# Altium schematic sheet Cat_feeder.SchDoc
size A
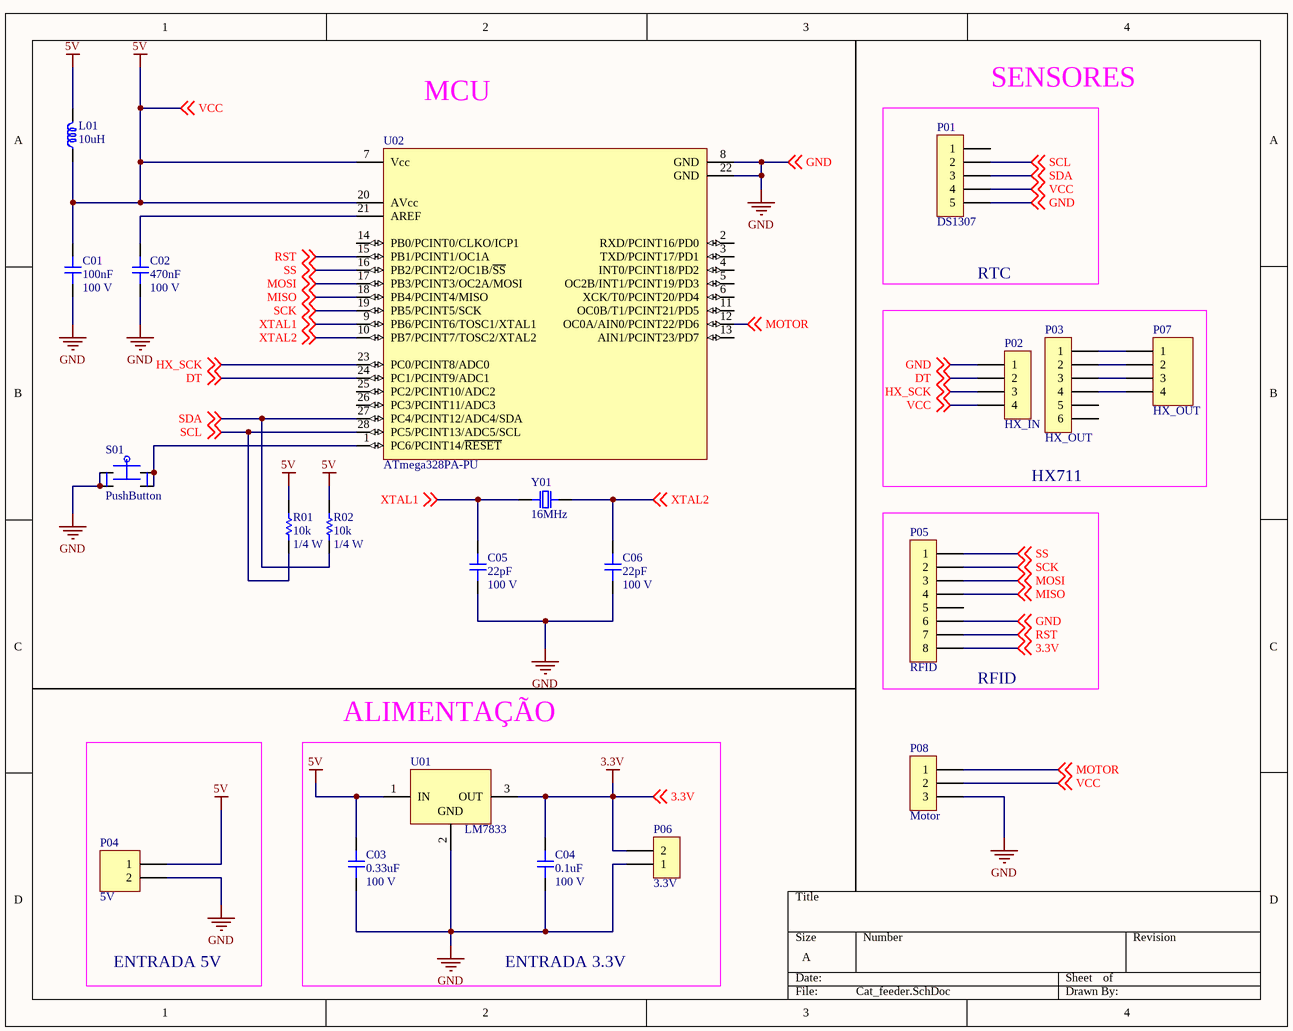
[diagram p0: Cat_feeder.SchDoc]

## Parts
C01  100nF  Voltage: 100 V  [C100-200-100]
C02  470nF  Voltage: 100 V  [C100-200-100]
C03  0.33uF  Voltage: 100 V  [C200-350-150]
C04  0.1uF  Voltage: 100 V  [C200-350-150]
C05  22pF  Voltage: 100 V  [C100-200-100]
C06  22pF  Voltage: 100 V  [C100-200-100]
L01  10uH  [L400-2.0mm]
P01  DS1307  [HDR-M-1x5-2.54mm-180-9.2mm]
P02  HX_IN  [HDR-M-1x4-2.54mm-180-21.1mm]
P03  HX_OUT  [HDR-M-1x6-2.54mm-180-9.2mm]
P04  5V  [KRE_2]
P05  RFID  [HDR-M-1x8-2.54mm-180-9.2mm]
P06  3.3V  [HDR-M-1x2-2.54mm-180-9.2mm]
P07  HX_OUT  [KRE_4]
P08  Motor  [HDR-M-1x3-2.54mm-180-9.2mm]
R01  10k  Power: 1/4 W  [R400-2.0mm]
R02  10k  Power: 1/4 W  [R400-2.0mm]
S01  PushButton  [DTS-6.0mm-6.0mm-THT]
U01  LM7833  [TO-220/123]
U02  ATmega328PA-PU  [DIP28-300(100)]
Y01  16MHz  [HC49-US-THT]

## Blocks framed on the sheet
SENSORES: P01
HX711: P02 P03 P07
RFID: P05
ENTRADA 5V: P04
ALIMENTAÇÃO: C03 C04 P06 U01

## Nets
3.3V: C04.2 P05.8 P06.2 U01.3(OUT) ; off-sheet 3.3V
5V: C01.2 C03.2 L01.1 L01.2 P01.4 P02.4 P04.1 P08.2 R01.2 R02.2 U01.1(IN) U02.7(Vcc) U02.20(AVcc) ; off-sheet VCC  [also labelled VCC]
GND: C01.1 C02.1 C03.1 C04.1 C05.1 C06.1 P01.5 P02.1 P04.2 P05.6 P06.1 P08.3 S01.1 S01.2 U01.2(GND) U02.8(GND) U02.22(GND) ; off-sheet GND
DT: P02.2 U02.24(PC1/PCINT9/ADC1) ; off-sheet DT
HX_SCK: P02.3 U02.23(PC0/PCINT8/ADC0) ; off-sheet HX_SCK
MISO: P05.4 U02.18(PB4/PCINT4/MISO) ; off-sheet MISO
MOSI: P05.3 U02.17(PB3/PCINT3/OC2A/MOSI) ; off-sheet MOSI
MOTOR: P08.1 U02.12(OC0A/AIN0/PCINT22/PD6) ; off-sheet MOTOR
RST: P05.7 U02.15(PB1/PCINT1/OC1A) ; off-sheet RST
SCK: P05.2 U02.19(PB5/PCINT5/SCK) ; off-sheet SCK
SCL: P01.2 R01.1 U02.28(PC5/PCINT13/ADC5/SCL) ; off-sheet SCL
SDA: P01.3 R02.1 U02.27(PC4/PCINT12/ADC4/SDA) ; off-sheet SDA
SS: P05.1 U02.16(PB2/PCINT2/OC1B/~{SS}) ; off-sheet SS
XTAL1: C05.2 U02.9(PB6/PCINT6/TOSC1/XTAL1) Y01.1 ; off-sheet XTAL1
XTAL2: C06.2 U02.10(PB7/PCINT7/TOSC2/XTAL2) Y01.2 ; off-sheet XTAL2
NetC02_2: C02.2 U02.21(AREF)
NetP03_1: P03.1 P07.1
NetP03_2: P03.2 P07.2
NetP03_3: P03.3 P07.3
NetP03_4: P03.4 P07.4
NetS01_3: S01.3 S01.4 U02.1(PC6/PCINT14/~{RESET})

Not connected (* = marked no-connect by the designer): P01 1; P03 5 6; P05 5; U02 2(RXD/PCINT16/PD0) 3(TXD/PCINT17/PD1) 4(INT0/PCINT18/PD2) 5(OC2B/INT1/PCINT19/PD3) 6(XCK/T0/PCINT20/PD4) 11(OC0B/T1/PCINT21/PD5) 13(AIN1/PCINT23/PD7) 14(PB0/PCINT0/CLKO/ICP1) 25(PC2/PCINT10/ADC2) 26(PC3/PCINT11/ADC3)

## Notes on the sheet
- MCU
- RTC
- ENTRADA 3.3V

## Library data of the parts
C01 C02 C03 C04 C05 C06 = Capacitor: Published: 8-Jun-2000; LatestRevisionDate: 17-Jul-2002; LatestRevisionNote: Re-released for DXP Platform.; PackageReference: RAD-0.3; Publisher: Altium Limited
L01 = Inductor
P01 = Header_1x5: Header, 1 Line, 5 Columns, 5 Pins; LatestRevisionDate: 17-Jul-2002; LatestRevisionNote: Re-released for DXP Platform.; Publisher: Altium Limited
P02 = Header_1x4: Header, 1 Line, 4 Columns, 4 Pins; LatestRevisionDate: 17-Jul-2002; LatestRevisionNote: Re-released for DXP Platform.; Publisher: Altium Limited
P03 = Header_1x6: Header, 1 Line, 6 Columns, 6 Pins; LatestRevisionDate: 17-Jul-2002; LatestRevisionNote: Re-released for DXP Platform.; Publisher: Altium Limited
P04 = KRE_2: Terminal Block 1x2
P05 = Header_1x8: Header, 1 Line, 8 Columns, 8 Pins; LatestRevisionDate: 17-Jul-2002; LatestRevisionNote: Re-released for DXP Platform.; Publisher: Altium Limited
P06 = Header_1x2: Header, 1 Line, 2 Columns, 2 Pins; LatestRevisionDate: 17-Jul-2002; LatestRevisionNote: Re-released for DXP Platform.; Publisher: Altium Limited
P07 = KRE_4: Terminal Block 1x4
P08 = Header_1x3: Header, 1 Line, 3 Columns, 3 Pins; LatestRevisionDate: 17-Jul-2002; LatestRevisionNote: Re-released for DXP Platform.; Publisher: Altium Limited
R01 R02 = Resistor: Tolerance: 5%; Published: 8-Jun-2000; LatestRevisionDate: 17-Jul-2002; LatestRevisionNote: Re-released for DXP Platform.; PackageReference: AXIAL-0.3; Publisher: Altium Limited
S01 = PushButton_4: Tactile Switch SPST 4 pins
U01 = LM7805CT: 3-Terminal 1 A Positive 5 V Voltage Regulator
U02 = ATmega328PA-PU: 8-bit AVR Microcontroller with 32 KB In-System Programmable Flash; Flash Memory: 32 KB; EEPROM Memory: 1 KB; SRAM Memory: 2 KB; Timer 8 bits: 2; Timer 16 bits: 1; PWM Channel: 6; I/O Pins: 23; Supply Voltage (Vdd): 1.8 - 5.5 V; Clock Frequency: 0 - 20 MHz; Debug: debugWire; ADC Channel: 6; Serial USART: 1; Serial SPI: 1; Serial I2C: 1; Analog Comparator: 1
Y01 = Crystal